# Altium schematic sheet Sheet1.SchDoc: Arduino cc1101 shield
size A4; Date: *******; ApprovedBy: *******; CheckedBy: None; Author: *******; CompanyName: *******; DrawnBy: Esmaeill M; Engineer: *******; Organization: *******; Address1: *******; Address2: *******; Address3: *******; Address4: *******; Revision: *******; SheetNumber: 1; SheetTotal: 1; Address_Website: www.ioelectro.ir; Address_City: Bushehr,Iran; Company: IOElectro; ProjectNumber: 1077; Version: 0.1; CurrentTime: *******; CurrentDate: *******; Time: *******; DocumentFullPathAndName: *******; DocumentName: *******; ModifiedDate: *******; ImagePath: *******; ProjectName: *******; Application_BuildNumber: *******
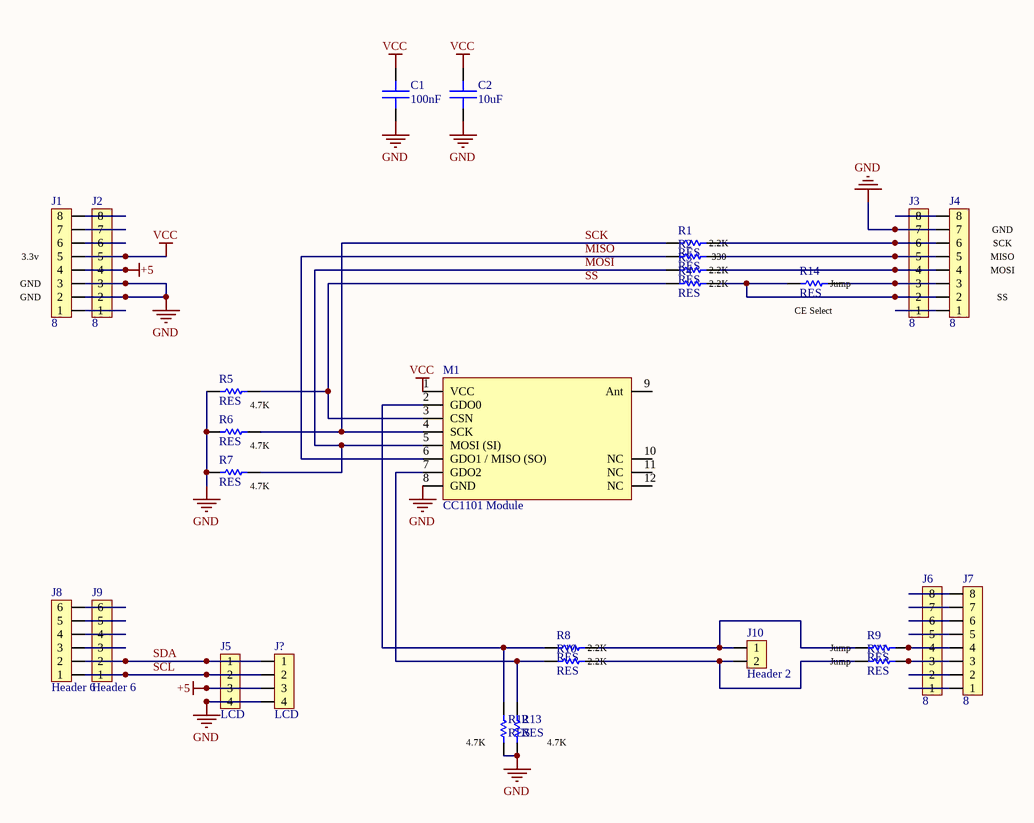
[diagram p0: Sheet1.SchDoc]

## Parts
C1  100nF  [C-0805]
C2  10uF  [C-0805]
J1  8  [PH-1X8]
J2  8  [PH-1X8]
J3  8  [PH-1X8]
J4  8  [PH-1X8]
J5  LCD  [PH-1X4]
J6  8  [PH-1X8]
J7  8  [PH-1X8]
J8  Header 6  [PH-1X6]
J9  Header 6  [PH-1X6]
J10  Header 2  [PH-1X2-N3D]
J?  LCD  [PH-1X4]
M1  CC1101 Module  [CC1101-Module-Red]
R1  RES  [R-0805]
R2  RES  [R-0805]
R3  RES  [R-0805]
R4  RES  [R-0805]
R5  RES  [R-0805]
R6  RES  [R-0805]
R7  RES  [R-0805]
R8  RES  [R-0805]
R9  RES  [R-0805]
R10  RES  [R-0805]
R11  RES  [R-0805]
R12  RES  [R-0805]
R13  RES  [R-0805]
R14  RES  [R-0805]

## Nets
+5: J1.4 J2.4 J5.3 J?.3
GND: C1.2 C2.2 J1.2 J1.3 J2.2 J2.3 J3.7 J4.7 J5.4 J?.4 M1.8(GND) R5.2 R6.2 R7.2 R12.2 R13.2
VCC: C1.1 C2.1 J1.5 J2.5 M1.1(VCC)
MISO: M1.6(GDO1_/_MISO_(SO)) R2.1
MOSI: M1.5(MOSI_(SI)) R3.1 R7.1
SCK: M1.4(SCK) R1.1 R6.1
SCL: J5.2 J8.1 J9.1 J?.2
SDA: J5.1 J8.2 J9.2 J?.1
SS: M1.3(CSN) R4.1 R5.1
NetJ1_1: J1.1 J2.1
NetJ1_6: J1.6 J2.6
NetJ1_7: J1.7 J2.7
NetJ1_8: J1.8 J2.8
NetJ3_1: J3.1 J4.1
NetJ3_2: J3.2 J4.2 R4.2 R14.1
NetJ3_3: J3.3 J4.3 R14.2
NetJ3_4: J3.4 J4.4 R3.2
NetJ3_5: J3.5 J4.5 R2.2
NetJ3_6: J3.6 J4.6 R1.2
NetJ3_8: J3.8 J4.8
NetJ6_1: J6.1 J7.1
NetJ6_2: J6.2 J7.2
NetJ6_3: J6.3 J7.3 R11.1
NetJ6_4: J6.4 J7.4 R9.1
NetJ6_5: J6.5 J7.5
NetJ6_6: J6.6 J7.6
NetJ6_7: J6.7 J7.7
NetJ6_8: J6.8 J7.8
NetJ8_3: J8.3 J9.3
NetJ8_4: J8.4 J9.4
NetJ8_5: J8.5 J9.5
NetJ8_6: J8.6 J9.6
NetJ10_1: J10.1 R8.1 R9.2
NetJ10_2: J10.2 R10.1 R11.2
NetM1_2: M1.2(GDO0) R8.2 R12.1
NetM1_7: M1.7(GDO2) R10.2 R13.1

Not connected (* = marked no-connect by the designer): M1 9(Ant) 10(NC) 11(NC) 12(NC)

## Notes on the sheet
- (near J1) 3.3v
- (near J1) GND
- 330
- 2.2K
- (near R14) Jump
- (near J4) GND
- (near J4) SCK
- (near J4) MISO
- (near J4) MOSI
- (near R14) CE Select
- (near J4) SS
- (near R5) 4.7K
- (near R6) 4.7K
- (near R7) 4.7K
- Jump
- (near R12) 4.7K
- 4.7K
- Title:
- Size:
- Date:
- A4
- Project Number:
- Time:
- Revision:
- Sheet
- of
- Drawn By:
- IOElectro
- File:
- Note:

## Library data of the parts
C1 C2 = CAP: CAPACITOR BIPOLAR
J1-J4 J6 J7 = PH-1X8: PIN HEADER 1x8 2.56mm
J5 J? = PH-1X4: PIN HEADER 1x4 2.56mm
J8 J9 = PH-1X6: PIN HEADER 1x6 2.56mm
J10 = PH-1X2: PIN HEADER 1x2 2.56mm
M1 = HW-863: CC1101 Module Red; Voltage: 1.8-3.6V; Maximum power: 10mW; Central frequency band: 433MHz; Emission current: 29mA; Package type: patch / plug-in 1*8*1.27 SIP; Chip: CC1101; Color: Red; Size: 12*20.8